# Altium schematic sheet 20_MARK_HOLE.SchDoc
size A3
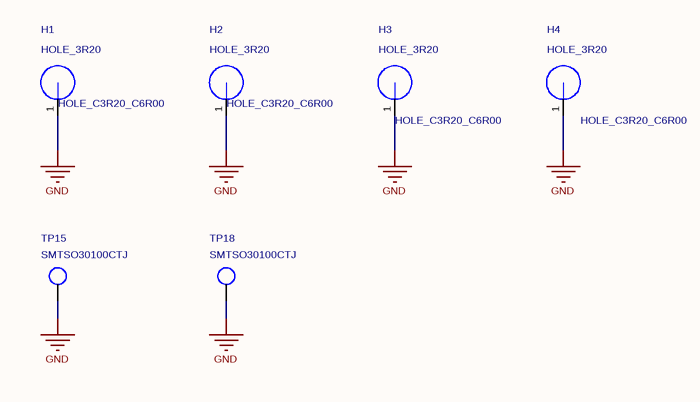
[diagram p0: 20_MARK_HOLE.SchDoc]

## Parts
H1  value HOLE_3R20  [HOLE_C3R20_C6R00]  (hidden comment: HOLE)
H2  value HOLE_3R20  [HOLE_C3R20_C6R00]  (hidden comment: HOLE)
H3  value HOLE_3R20  [HOLE_C3R20_C6R00]  (hidden comment: HOLE)
H4  value HOLE_3R20  [HOLE_C3R20_C6R00]  (hidden comment: HOLE)
TP15  value SMTSO30100CTJ  [PAD_10]  (hidden comment: SMTSO)
TP18  value SMTSO30100CTJ  [PAD_10]  (hidden comment: SMTSO)

## Nets
GND: H1.1 H2.1 H3.1 H4.1 TP15.1 TP18.1

## Notes on the sheet
- Title
- Size:
- Date:
- A3
- Number:
- Time:
- Revision:
- Sheet
- of
- File:

## Library data of the parts
H1 = HOLE: 直径3.2mm螺丝孔,无铜柱; Priority: A; Created_by: YWQ; Source_Path: Z:\RK_STANDARD_LIBRARY\CADENCE_CIS\RK_DISCRETE.OLB; Number: 1; Option: DNP; RK_PN: HOLE_3R20; Part_Type: HOLE; PCB DECAL: HOLE_C3R20_C6R00
H2-H4 = HOLE: 直径3.2mm螺丝孔,无铜柱; Created_by: YWQ; Priority: A; Source_Path: Z:\RK_STANDARD_LIBRARY\CADENCE_CIS\RK_DISCRETE.OLB; Number: 1; Option: DNP; Part_Type: HOLE; RK_PN: HOLE_3R20; PCB DECAL: HOLE_C3R20_C6R00
TP15 = SMTSO: 焊接螺母M3,高度10mm；; Created_by: JJJ; Priority: A; Source_Path: Z:\RK_STANDARD_LIBRARY\CADENCE_CIS\RK_DISCRETE.OLB; Option: DNP; Number: 1; Part_Type: SMTSO; RK_PN: SMTSO30100CTJ; PCB DECAL: PAD_10
TP18 = SMTSO: 焊接螺母M3,高度10mm；; Created_by: JJJ; Priority: A; Source_Path: Z:\RK_STANDARD_LIBRARY\CADENCE_CIS\RK_DISCRETE.OLB; Number: 1; Option: DNP; Part_Type: SMTSO; RK_PN: SMTSO30100CTJ; PCB DECAL: PAD_10